# Altium schematic sheet clap switch pcb.SchDoc
size A4; SheetNumber: 1; SheetTotal: 1
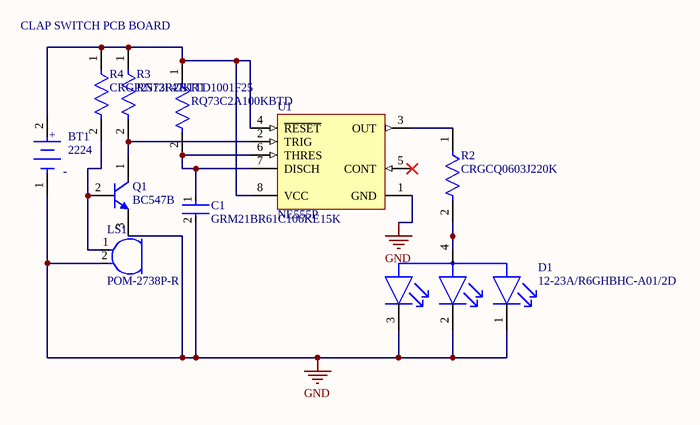
[diagram p0: clap switch pcb.SchDoc]

## Parts
BT1  2224  [FP-2224-MFG]
C1  GRM21BR61C106KE15K  [FP-GRM21B-0_1-MFG]
D1  12-23A/R6GHBHC-A01/2D  [FP-12-23A-MFG]
LS1  POM-2738P-R  [FP-POM-2738P-R-MFG]
Q1  BC547B  [ONSC-TO-92-3-29-11]
R1  RQ73C2A100KBTD  [FP-RQ73C2A-IPC_B]
R2  CRGCQ0603J220K  [FP-CRGCQ0603-IPC_C]
R3  RN73R2BTTD1001F25  [FP-RN73R2B-MFG]
R4  CRGP2512F47K  [FP-CRGP2512-IPC_C]
U1  NE555P  [P0008A]

## Nets
GND: BT1.1(C) C1.2 D1.1(RED_C) D1.2(GREEN_C) D1.3(BLUE_C) LS1.2(C) Q1.3(E) U1.1(GND)
NetBT1_2: BT1.2(A) R1.1 R3.1 R4.1 U1.4(~{RESET}) U1.8(VCC)
NetC1_1: C1.1 R1.2 U1.6(THRES) U1.7(DISCH)
NetD1_4: D1.4(COMMON_ANODE) R2.2
NetLS1_1: LS1.1(A) Q1.2(B) R4.2
NetQ1_1: Q1.1(C) R3.2 U1.2(TRIG)
NetR2_1: R2.1 U1.3(OUT)

Not connected (* = marked no-connect by the designer): U1 5(CONT)*

## Notes on the sheet
- CLAP SWITCH PCB BOARD
- (in symbol CMP-19636-000012-1) +

## Library data of the parts
BT1 = CMP-19636-000012-1: BATTERY HOLDER C PC PIN; Number of Cells: 1; Case/Package: Aluminum; Series: -; Lead Free: Lead Free; RoHS Compliant: No; Termination: PC Pin; Number of Batteries: 1; Material: Polyethylene; REACH SVHC: No SVHC; Package Quantity: 1; Packaging: Bulk; Mount: Through Hole
C1 = CMP-2007-03534-2: Chip Multilayer Ceramic Capacitors for General Purpose, 0805, 10uF, X5R, 15%, 10%, 16V; Case Code (Imperial): 0805; Packaging: Tape and Reel; Width: 0.049inch; Depth: 1.25mm; Voltage Rating: 16V; Height: 1.25mm; Case/Package: 0805; Max Operating Temperature: 85°C; Min Operating Temperature: -55°C; Tolerance: 10%; Dielectric: X5R; REACH SVHC: No SVHC; Mount: Surface Mount; Radiation Hardening: No; Case Code (Metric): 2012; Length: 2mm; Package Quantity: 10000; Voltage Rating (DC): 16V; Voltage: 16V; Capacitance: 10uF; Thickness: 0.053inch; Termination: SMD/SMT
D1 = CMP-51564-000005-1: LED RGB CLEAR CHIP SMD R/A; Manufacturer: Everlight; Colour: Red, Green, Blue; Forward Current: 20mA; Forward Voltage: 2/3.3/3.3V; Viewing Angle: 120°; Led Orientation: Side View; Luminous Intensity: 90/180/72mcd; Wavelength: 624/525/470nm; Reverse Voltage: 5V; Peak Emmision Wavelength: 632/518/468nm; Power Dissipation: 60/110/110mW; Description: Standard LEDs - SMD RGB WATER CLEAR RIGHT ANGLE LENS; Digikey Description: LED RGB CLEAR CHIP SMD R/A; Octopart: https://octopart.com/12-23a%2Fr6ghbhc-a01%2F2d-everlight-10561613; ComponentLink2Description: Datasheet; Lead Free: Yes; Device Class L2: LEDs; Automotive: No; Mouser Description: Standard LEDs - SMD RGB WATER CLEAR RIGHT ANGLE LENS; Category: Diode; Device Class L3: unset; Temperature Range Low: -40°C; Package: 12-23A; Device Class L1: Optoelectronics; Temperature Range High: +85°C; Height: 2.1mm; RoHS: TRUE; Temperature: -40°C to +85°C; ComponentLink2URL: https://media.digikey.com/pdf/Data%20Sheets/Everlight%20PDFs/12-23A,R6GHBHC-A01,2D.pdf; Manufacturer Part Number: 12-23A/R6GHBHC-A01/2D
LS1 = CMP-103887-000001-1: MIC COND ANALOG OMNI -38DB; Manufacturer: PUI Audio, Inc.; Current: 0.5mA; Direction: Omidirectional; Value: 2.2kΩ; Operating Supply Voltage: 2V; Max Supply Voltage: 10V; Package: 0; Device Class L3: Microphones; Device Class L2: Audio Products; Octopart: https://octopart.com/pom-2738p-r-pui+audio-19251807; Manufacturer Part Number: POM-2738P-R; Height: 2.9mm; Mouser Description: Mic Omni-Directional 2200Ohm -38±3dB 10Vdc Round Pin; Lead Free: Yes; Automotive: No; RoHS: TRUE; ComponentLink2Description: Datasheet; Category: Speak; Device Class L1: Electromechanical; Digikey Description: MIC COND ANALOG OMNI -38DB; ComponentLink2URL: http://www.puiaudio.com/pdf/POM-2738P-R.pdf; Resistance: 2.2kΩ
Q1 = CMP-1048-01467-1: Amplifier Transistor, NPN Silicon, 3-Pin TO-92, Bulk Box; Manufacturer: On Semiconductor; IC Continuous (A): 0.1; fT Min (MHz): 150; DatasheetVersion: Rev. 7; ComponentLink1URL: http://www.onsemi.com/; Polarity: NPN; RoHS: FALSE; ComponentLink1Description: Manufacturer URL; Packing: Bulk Box; PackageDescription: 3-Pin Transistor Outline, Body 4.825 x 3.685 mm, Pitch 1.27 mm; ComponentLink3URL: http://www.onsemi.cn/pub_link/Collateral/2N6426-D.PDF; ComponentLink2Description: Datasheet; PackageVersion: Rev. AM; PackageReference: TO-92-3-29-11_AM_SL; ComponentLink3Description: Package Specification; Mounting Technology: Through Hole; PartNumber: BC547B; ComponentLink2URL: http://www.onsemi.com/pub_link/Collateral/BC546-D.PDF
R1 = CMP-03211-011351-1: RQ73 0805 100KΩ 0.2W 10ppm/°C 0.1% 100V
R2 = CMP-03211-002747-1: CRGCQ0603 220KΩ 5% ±100ppm/°C 75V; Manufacturer: TE Connectivity; Tolerance: 0.05; Power Rating: 0.1W; RoHS: TRUE; Voltage Rating: 75V; Composition: Thick Film; ComponentLink2URL: https://www.te.com/commerce/DocumentDelivery/DDEController?Action=showdoc&DocId=Data+Sheet%7F1773204-3%7F1%7Fpdf%7FEnglish%7FENG_DS_1773204-3_1.pdf%7F4-2176339-1223; Manufacturer Part Number: CRGCQ0603J220K; ComponentLink2Description: Datasheet; Octopart: https://octopart.com/crgcq0603j220k-te+connectivity-91018110; Value: 220KΩ; Temperature: -55°C to +155°C; Temperature Range High: +155°C; Lead Free: Yes; Device Class L3: Chip SMD Resistors; Device Class L1: Passive Components; Temperature Coefficient: ±100ppm/°C; Ambient Temperature Range High: +70°C; Package: CRGCQ0603; Temperature Range Low: -55°C; Height: 0.55mm; Resistance: 220KΩ; Category: Res; Series: CRGCQ; Ipc Land Pattern Name: RESC16080X45; Device Class L2: Resistors
R3 = CMP-04015-029161-1: 1kΩ ±1% 0.25W, 1/4W Chip Resistor 1206 (3216 Metric) Moisture Resistant Thin Film
R4 = CMP-03211-002823-1: CRGP 2512 47K 1%; Manufacturer: TE; Description: CRGP2512 47KΩ 2W ±100ppm/°C 1% 500V; Resistance: 47KΩ; Value: 47KΩ; Tolerance: 0.01; Voltage Rating: 500V; Power Rating: 2W; Temperature Coefficient: ±100ppm/°C; RoHS: TRUE; Package: CRGP2512; Composition: Thick Film; Device Class L2: Resistors; Lead Free: Yes; Digikey Description: CRGP 2512 47K 1%; Automotive: No; Temperature: -55°C to +155°C; Height: 0.65mm; Device Class L3: Chip SMD Resistors; Octopart: https://octopart.com/crgp2512f47k-te+connectivity-91019068; Temperature Range High: +155°C; ComponentLink2URL: https://www.mouser.ca/datasheet/2/418/NG_DS_9-1773463-9_A-1358566.pdf; Temperature Range Low: -55°C; Device Class L1: Passive Components; Series: CRGP; Category: Res; Manufacturer Part Number: CRGP2512F47K; ComponentLink2Description: Datasheet; Ipc Land Pattern Name: RESC635320X55; Ambient Temperature Range High: +70°C
U1 = CMP-2000-04954-1: Precision Timer, 4.5 to 16 V, 0 to 70 degC, 8-Pin DIP, Pb-Free, Tube; Manufacturer: TexasInstruments; Maximum High Level Output Current: -200mA; Number of Internal Timers: 1; Operating Supply Voltage: 5; Maximum Low Level Output Current: 200mA; Rad Hard: No; Packaging: Rail/Tube; Manufacturer URL: http://www.ti.com/; Package Reference: P8; Package Description: 8-Pin Double In-line Package, Body 9.59 x 6.35 mm, Pitch 2.54 mm; Package URL: http://www.ti.com/lit/ml/mpdi001b/mpdi001b.pdf; Type: Standard; Datasheet URL: http://www.ti.com/general/docs/lit/getliterature.tsp?genericPartNumber=NE555&fileType=pdf; Category: Timer; Package: 8PDIP; Datasheet Version: Rev. I, 09/2014